# Altium schematic sheet TC1047温度传感器.SchDoc: TC1047温度传感器
size A4; Engineer: 涵尘; SheetNumber: 8
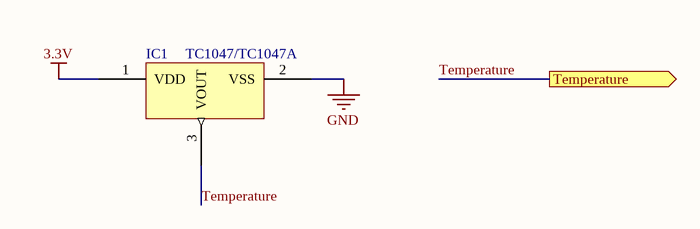
[diagram p0: TC1047温度传感器.SchDoc]

## Parts
IC1  TC1047/TC1047A  [SOT23-3L]

## Ports
Temperature (out)

## Nets
3.3V: IC1.1(VDD)
GND: IC1.2(VSS)
Temperature: IC1.3(VOUT) ; port Temperature

## Library data of the parts
IC1 = TC1047/TC1047A: 温度传感器 温度=(电压-500mV)÷10，测温范围-40℃~125℃